# EAGLE design usb 8 button keyboard (EAGLE 7.6.0)
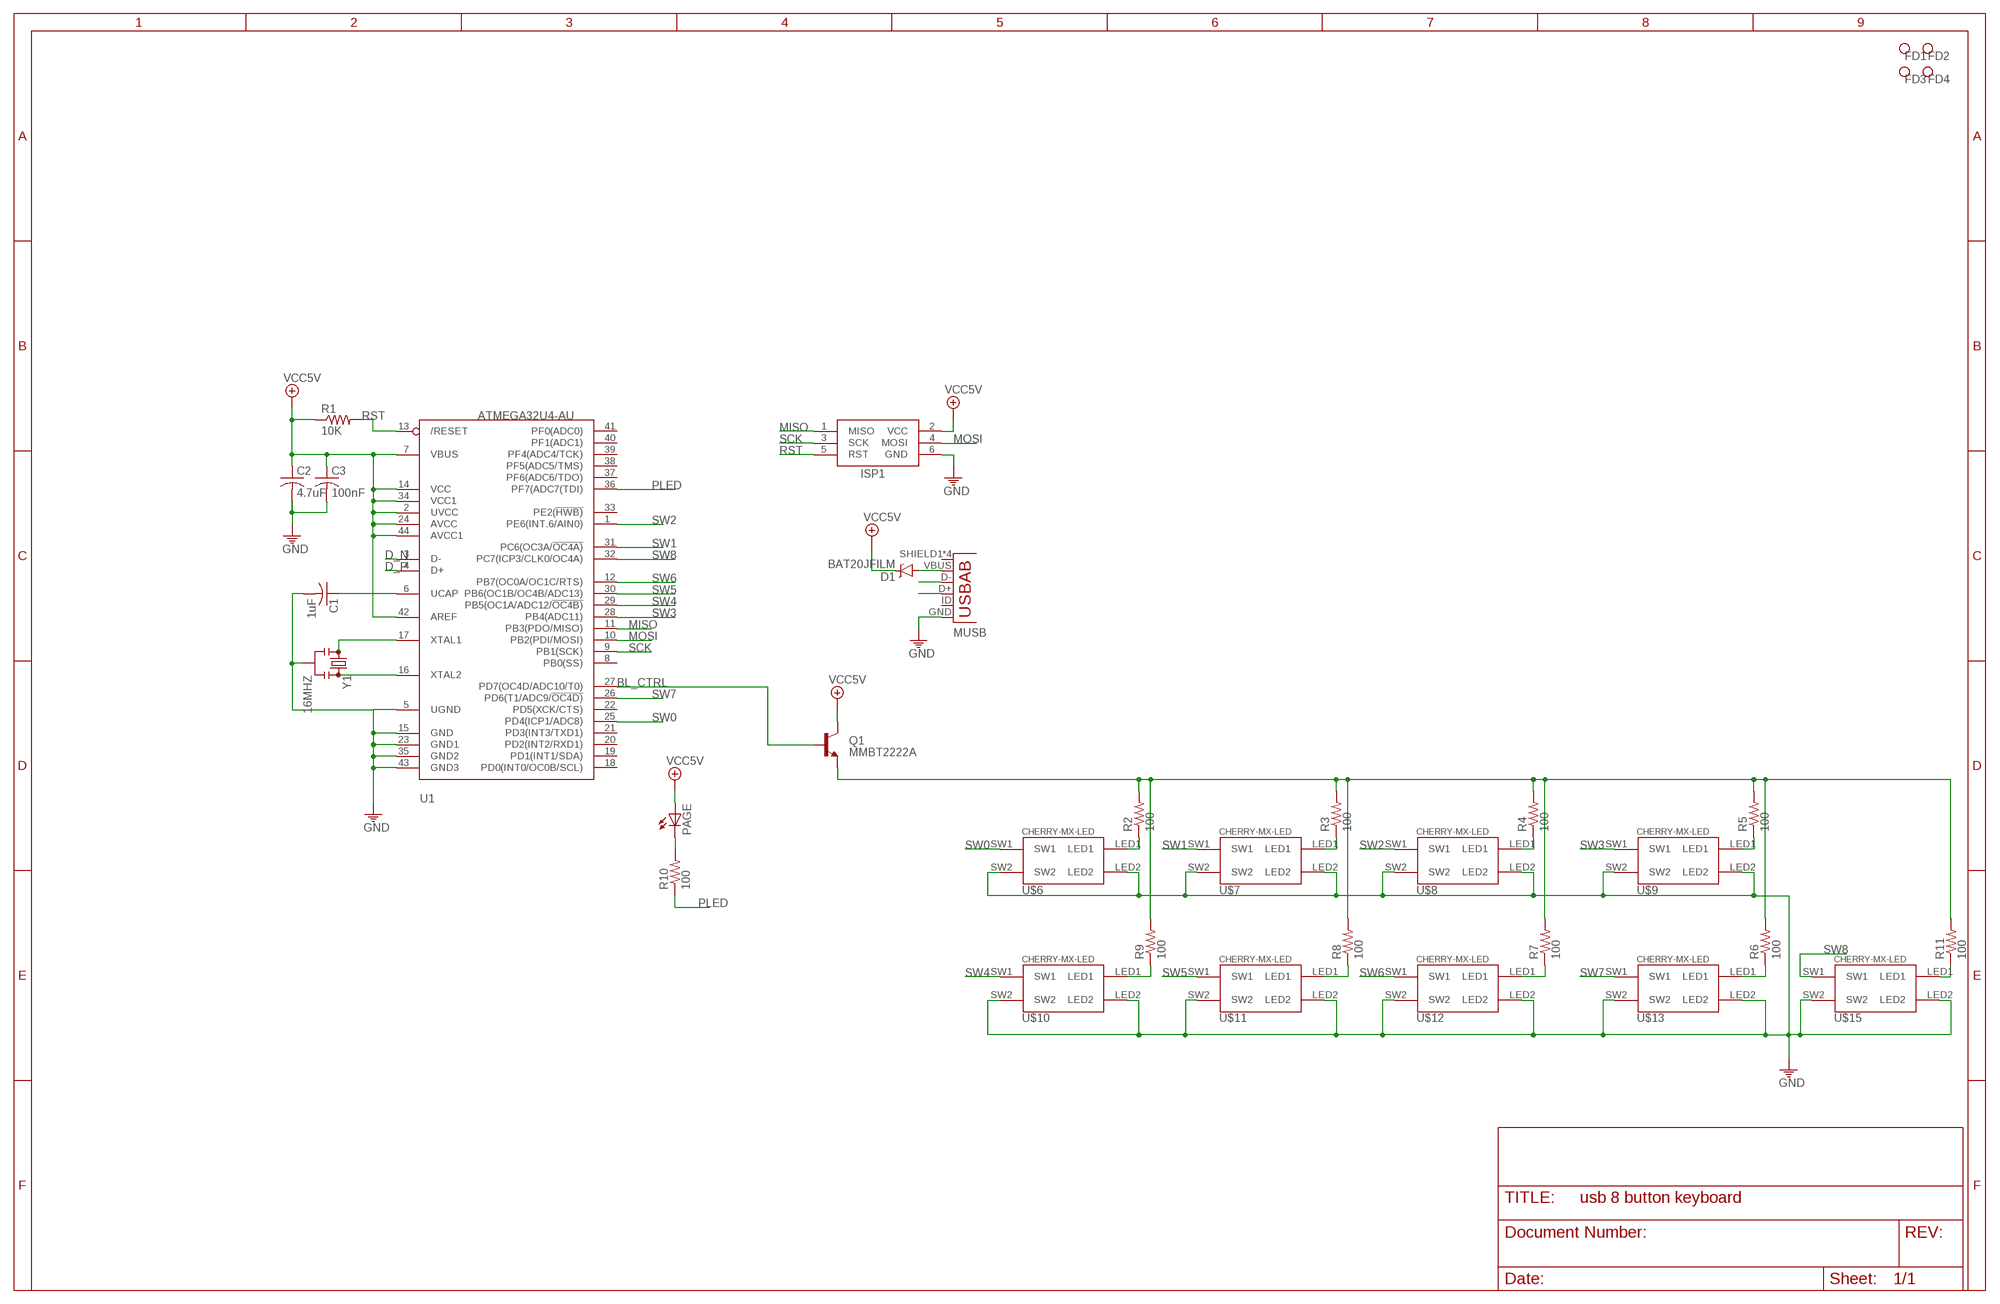
[diagram p0: schematic, sheet 1]

## Parts
C1  1uF  C-USC0402  [C0402]
C2  4.7uF  C-USC0402  [C0402]
C3  100nF  C-USC0402  [C0402]
D1  BAT20JFILM  [SOD-323]
FD1  FIDUCIAL  [FIDUCIAL_1MM]
FD2  FIDUCIAL  [FIDUCIAL_1MM]
FD3  FIDUCIAL  [FIDUCIAL_1MM]
FD4  FIDUCIAL  [FIDUCIAL_1MM]
ISP1  AVRISP-6  [AVRISP]
MUSB  USB-AB  [USB-AB-MICRO-SMD]
PAGE  LEDCHIP-LED0603  [CHIP-LED0603]
Q1  MMBT2222A  TRANSISTOR_NPNMMBT2222A  [SOT23-3]
R1  10K  R-US_R0402  [R0402]
R2  100  R-US_R0402  [R0402]
R3  100  R-US_R0402  [R0402]
R4  100  R-US_R0402  [R0402]
R5  100  R-US_R0402  [R0402]
R6  100  R-US_R0402  [R0402]
R7  100  R-US_R0402  [R0402]
R8  100  R-US_R0402  [R0402]
R9  100  R-US_R0402  [R0402]
R10  100  R-US_R0402  [R0402]
R11  100  R-US_R0402  [R0402]
U1  ATMEGA32U4-AU  [TQFP44]
U$6  CHERRY-MX-LED  [CHERRY-MX-LED]
U$7  CHERRY-MX-LED  [CHERRY-MX-LED]
U$8  CHERRY-MX-LED  [CHERRY-MX-LED]
U$9  CHERRY-MX-LED  [CHERRY-MX-LED]
U$10  CHERRY-MX-LED  [CHERRY-MX-LED]
U$11  CHERRY-MX-LED  [CHERRY-MX-LED]
U$12  CHERRY-MX-LED  [CHERRY-MX-LED]
U$13  CHERRY-MX-LED  [CHERRY-MX-LED]
U$15  CHERRY-MX-LED  [CHERRY-MX-LED]
Y1  16MHZ  RESONATOR16MHZ  [RESONATOR-SMD]

## Nets
BL: Q1.2(E) R2.2 R3.2 R4.2 R5.2 R6.2 R7.2 R8.2 R9.2 R11.2
BL_CTRL: Q1.1(B) U1.27(PD7(OC4D/ADC10/T0))
D_N: MUSB.D- U1.3(D-)
D_P: MUSB.D+ U1.4(D+)
GND: C1.2 C2.2 C3.2 ISP1.6(GND) MUSB.GND U1.5(UGND) U1.15(GND) U1.23(GND1) U1.35(GND2) U1.43(GND3) U$6.LED2 U$6.SW2 U$7.LED2 U$7.SW2 U$8.LED2 U$8.SW2 U$9.LED2 U$9.SW2 U$10.LED2 U$10.SW2 U$11.LED2 U$11.SW2 U$12.LED2 U$12.SW2 U$13.LED2 U$13.SW2 U$15.LED2 U$15.SW2 Y1.2
MISO: ISP1.1(MISO) U1.11(PB3(PDO/MISO))
MOSI: ISP1.4(MOSI) U1.10(PB2(PDI/MOSI))
N$2: D1.A MUSB.VBUS
N$3: PAGE.C R10.2
N$4: R11.1 U$15.LED1
N$5: R2.1 U$6.LED1
N$6: U1.16(XTAL2) Y1.3
N$7: U1.17(XTAL1) Y1.1
N$8: C1.1 U1.6(UCAP)
N$9: R3.1 U$7.LED1
N$10: R4.1 U$8.LED1
N$11: R5.1 U$9.LED1
N$12: R6.1 U$13.LED1
N$13: R7.1 U$12.LED1
N$14: R8.1 U$11.LED1
N$15: R9.1 U$10.LED1
PLED: R10.1 U1.36(PF7(ADC7(TDI))
RST: ISP1.5(RST) R1.2 U1.13(/RESET)
SCK: ISP1.3(SCK) U1.9(PB1(SCK))
SW0: U1.25(PD4(ICP1/ADC8)) U$6.SW1
SW1: U1.31(PC6(OC3A/!OC4A)) U$7.SW1
SW2: U1.1(PE6(INT.6/AIN0)) U$8.SW1
SW3: U1.28(PB4(ADC11)) U$9.SW1
SW4: U1.29(PB5(OC1A/ADC12/!OC4B)) U$10.SW1
SW5: U1.30(PB6(OC1B/OC4B/ADC13)) U$11.SW1
SW6: U1.12(PB7(OC0A/OC1C/RTS)) U$12.SW1
SW7: U1.26(PD6(T1/ADC9/!OC4D)) U$13.SW1
SW8: U1.32(PC7(ICP3/CLK0/OC4A)) U$15.SW1
VCC5V: C2.1 C3.1 D1.C ISP1.2(VCC) PAGE.A Q1.3(C) R1.1 U1.2(UVCC) U1.7(VBUS) U1.14(VCC) U1.24(AVCC) U1.34(VCC1) U1.42(AREF) U1.44(AVCC1)
Unconnected: MUSB.ID(USBID) MUSB.SHIELD1(SHIELD) MUSB.SHIELD2(SHIELD) MUSB.SHIELD3(SHIELD) MUSB.SHIELD4(SHIELD) U1.8(PB0(SS)) U1.18(PD0(INT0/OC0B/SCL)) U1.19(PD1(INT1/SDA)) U1.20(PD2(INT2/RXD1)) U1.21(PD3(INT3/TXD1)) U1.22(PD5(XCK/CTS)) U1.33(PE2(!HWB)) U1.37(PF6(ADC6/TDO)) U1.38(PF5(ADC5/TMS)) U1.39(PF4(ADC4/TCK)) U1.40(PF1(ADC1)) U1.41(PF0(ADC0))

## Library data of the parts
C1-C3 = cheeper:C-US: CAPACITOR, American symbol
D1 = SparkFun-DiscreteSemi:BAT20JFILM: 23V, 1A Schottky diode, SOD-323 package; PROD_ID: DIO-11623
FD1-FD4 = ChipTestJig:FIDUCIAL; ASSEMBLE: N.C; DESCRIPTION: Fiducial; PART_NUMBER: RB00000042
ISP1 = adafruit:AVRISP: AVR ISP HEADER Standard 6 pin header for AVR programming
MUSB = SparkFun-Connectors:USB-AB: This is a USB AB connector that is compatible with USB OTG. i.e. this connector can serve as a host or device
PAGE = adafruit:LED: LED OSRAM: - CHIPLED LG R971, LG N971, LY N971, LG Q971, LY Q971, LO R971, LY R971 LH N974, LH R974 LS Q976, LO Q976, LY Q976 LO Q996 - Hyper CHIPLED LW Q18S LB Q993, LB Q99A, LB R99A - SideLED LS A670, LO A670, LY A670, LG A670, LP A670 LB A673, LV A673, LT A673, LW A673 LH A674 LY A675 LS A676, LA A676, LO A676, LY A676, LW A676 LS A679, LY A679, LG A679 - Hyper Micro SIDELED® LS Y876, LA Y876, LO Y876, LY Y876 LT Y87S - SmartLED LW L88C, LW L88S LB L89C, LB L89S, LG L890 LS L89K, LO L89K, LY L89K LS L896, LA L896, LO L896, LY L896 - TOPLED LS T670, LO T670, LY T670, LG T670, LP T670 LSG T670, LSP T670, LSY T670, LOP T670, LYG T670 LG T671, LOG T671, LSG T671 LB T673, LV T673, LT T673, LW T673 LH T674 LS T676, LA T676, LO T676, LY T676, LB T676, LH T676, LSB T676, LW T676 LB T67C, LV T67C, LT T67C, LS T67K, LO T67K, LY T67K, LW E67C LS E67B, LA E67B, LO E67B, LY E67B, LB E67C, LV E67C, LT E67C LW T67C LS T679, LY T679, LG T679 LS T770, LO T770, LY T770, LG T770, LP T770 LB T773, LV T773, LT T773, LW T773 LH T774 LS E675, LA E675, LY E675, LS T675 LS T776, LA T776, LO T776, LY T776, LB T776 LHGB T686 LT T68C, LB T68C - Hyper Mini TOPLED® LB M676 - Mini TOPLED Santana® LG M470 LS M47K, LO M47K, LY M47K Source: http://www.osram.convergy.de/
Q1 = SparkFun-DiscreteSemi:TRANSISTOR_NPN: Generic NPN BJT MMBT2222A - TRANS-08049 (SOT-23, 1A 40V) MPSA42 - TRANS-09116 (SOT-23, 500mA 300V) MMBT5088LT1G - TRANS-11160 (SOT-23, 50 mA 30V) BC547 - COM-08928 <http://www.sparkfun.com/products/8928> (TO-92 45V 100mA) (1.Collector 2.Base 3.Emitter) 2N3904 - COM-00521 <http://www.sparkfun.com/products/521> (TO-92 40V 200mA) (1.Emitter 2.Base 3.Collector) P2N2222A - COM-12852 <http://www.sparkfun.com/products/12852> (TO-92 40V 600mA) (1.Collector 2.Base 3.Emitter); PROD_ID: TRANS-08049
R1-R11 = cheeper:R-US_: RESISTOR, American symbol
U1 = adafruit:ATMEGA32U4: http://www.ladyada.net/library/eagle
U$6-U$13 U$15 = cherrymx:CHERRY-MX-LED: Cherry MX series keyswitch with LED
Y1 = SparkFun-FreqCtrl:RESONATOR: Resonator Small SMD resonator. Used, eg, on the Arduino Pro/ Pro Mini boards. 8MHz- XTAL-08895 16MHz- XTAL-08900; PROD_ID: XTAL-08900

## Board
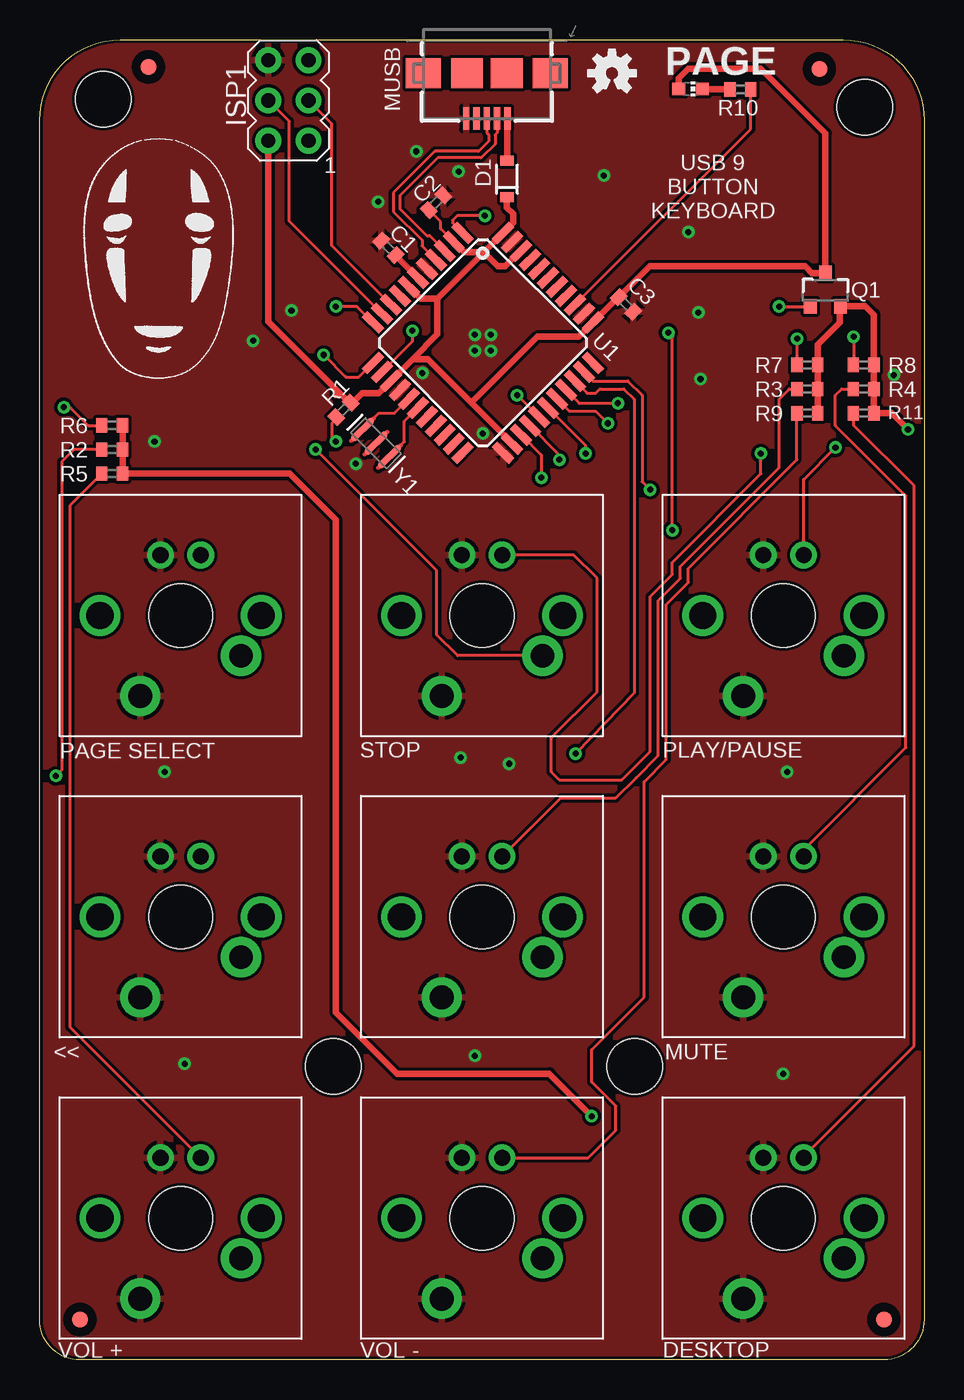
[diagram p1: board, top side]
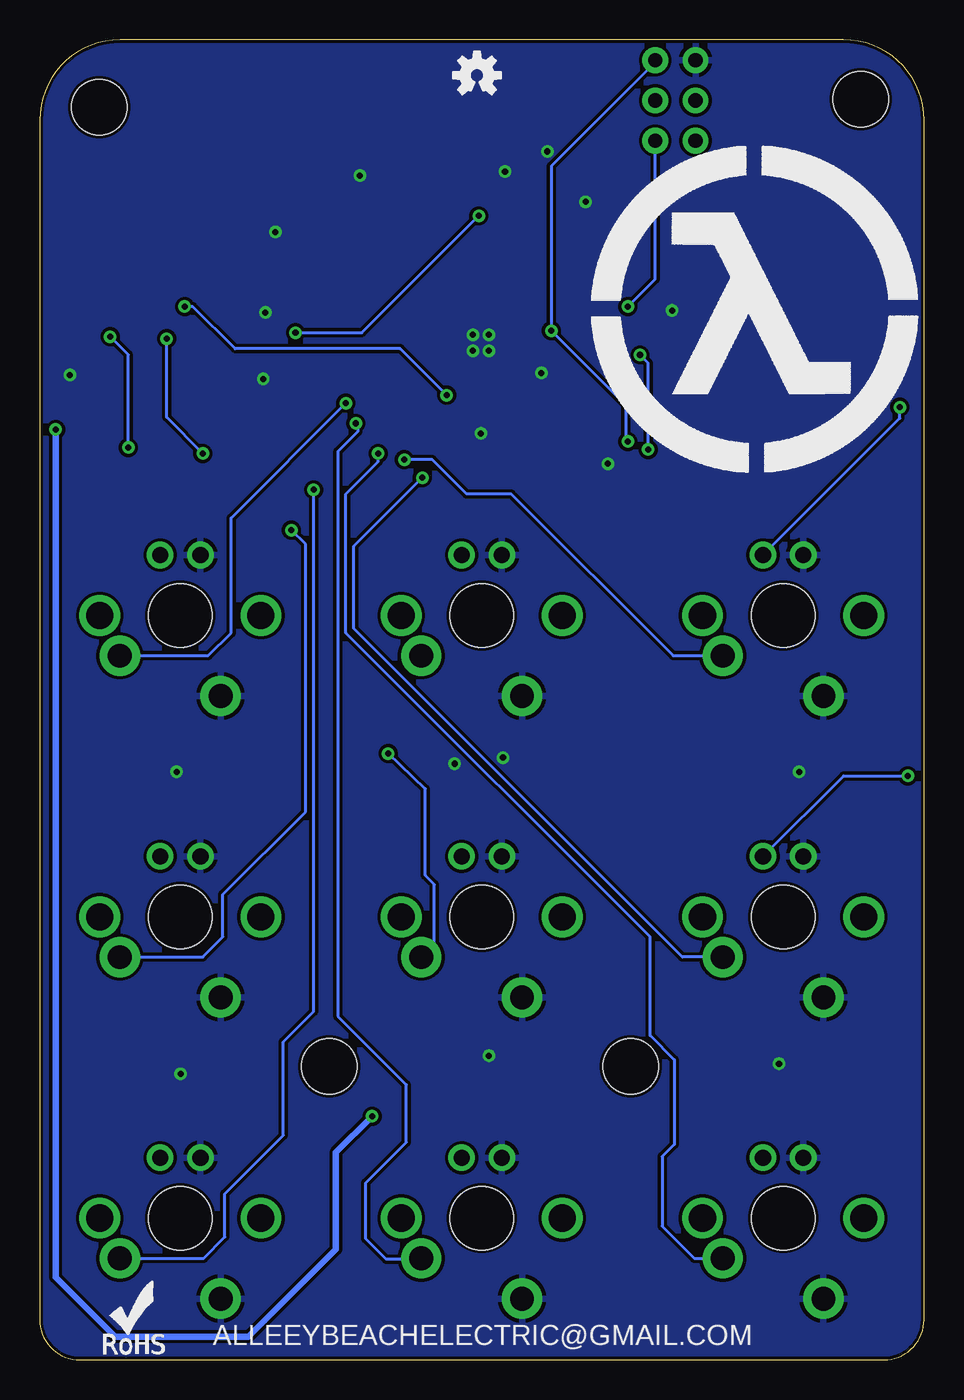
[diagram p2: board, bottom side, seen from below]

Size 55.75 x 83.25 mm. Coordinates in mm from the lower left corner, seen from the top.
Outline: 53.21,0 2.54,0 arc-90 0,2.54 0,78.17 arc-90 5.08,83.25 50.67,83.25 arc-90 55.75,78.17 55.75,2.54 arc-90 53.21,0
Copper layers (1*2*15*16): Top 0.035mm / dielectric 0.2mm / Route2 0.035mm / dielectric 0.2mm / Route15 0.035mm / dielectric 0.2mm / Bottom 0.035mm
Design rules "NTC": minimum track width 7mil, minimum drill 10mil, track to track 8mil, track to pad 8mil, pad to pad 8mil, via to via 8mil, smd to smd 3mil, copper to edge 8mil, drill to drill 8mil, minimum pad ring 10mil, minimum via ring 8mil, stop-mask expansion 4mil, vias tented up to drill 0.3mm, thermal gap 10mil
Holes 3.5 mm at 18.5,18.5 4,79.5 52,79 37.5,18.5

### Footprints (pad centres in the part's own frame; a part is rotated, then mirrored left to right if it is on the bottom)
C0402 = smd 0.7 x 0.9: 1 -0.65,0; 2 0.65,0
SOD-323 = smd 0.63 x 0.83: A 1.15,0; C -1.15,0
FIDUCIAL_1MM = smd 1 x 1: 1 0,0
AVRISP = drill 0.9 pad 1.626: 1 -1.27,2.54; 2 1.27,2.54; 3 -1.27,0; 4 1.27,0; 5 -1.27,-2.54; 6 1.27,-2.54
USB-AB-MICRO-SMD = smd 1.4 x 0.4: D+ 2.85,0; D- 2.85,0.65; GND 2.85,-1.3; ID 2.85,-0.65; VBUS 2.85,1.3 | smd 1.9 x 2.2: SHIELD1 0,4; SHIELD4 0,-4 | smd 1.9 x 2: SHIELD2 0,1.25; SHIELD3 0,-1.25
CHIP-LED0603 = smd 0.8 x 0.8: A 0,-0.75; C 0,0.75
SOT23-3 = smd 0.8 x 0.9: 1 -0.95,-1; 2 0.95,-1; 3 0,1.1
R0402 = smd 0.7 x 0.9: 1 -0.65,0; 2 0.65,0
TQFP44 = smd 1.5 x 0.5: 1 -5.8,4; 2 -5.8,3.2; 3 -5.8,2.4; 4 -5.8,1.6; 5 -5.8,0.8; 6 -5.8,0; 7 -5.8,-0.8; 8 -5.8,-1.6; 9 -5.8,-2.4; 10 -5.8,-3.2; 11 -5.8,-4; 23 5.8,-4; 24 5.8,-3.2; 25 5.8,-2.4; 26 5.8,-1.6; 27 5.8,-0.8; 28 5.8,0; 29 5.8,0.8; 30 5.8,1.6; 31 5.8,2.4; 32 5.8,3.2; 33 5.8,4 | smd 0.5 x 1.5: 12 -4,-5.8; 13 -3.2,-5.8; 14 -2.4,-5.8; 15 -1.6,-5.8; 16 -0.8,-5.8; 17 0,-5.8; 18 0.8,-5.8; 19 1.6,-5.8; 20 2.4,-5.8; 21 3.2,-5.8; 22 4,-5.8; 34 4,5.8; 35 3.2,5.8; 36 2.4,5.8; 37 1.6,5.8; 38 0.8,5.8; 39 0,5.8; 40 -0.8,5.8; 41 -1.6,5.8; 42 -2.4,5.8; 43 -3.2,5.8; 44 -4,5.8
CHERRY-MX-LED = drill 1.016 pad 1.676: LED1 -1.27,-3.81; LED2 1.27,-3.81 | drill 1.714 pad 1.93: P$3 -5.08,0; P$4 5.08,0 | drill 1.5 pad 2.54: SW1 -3.81,2.54; SW2 2.54,5.08 | hole 4: 0,0
RESONATOR-SMD = smd 0.45 x 1.905: 1 -1.2,0; 2 0,0; 3 1.2,0

### Placement (x,y rotation side)
C1  21.98,70.13 135 top
C2  24.99,72.97 45 top
C3  36.96,66.55 315 top
D1  29.46,74.46 90 top
FD1  2.54,2.54 0 top
FD2  6.86,81.53 0 top
FD3  49.15,81.41 0 top
FD4  53.21,2.54 0 top
ISP1  15.68,79.41 180 top
MUSB  28.19,81.13 270 top
PAGE  41.04,80.14 270 top
Q1  49.53,67.44 0 top
R1  19.16,59.9 225 top
R2  4.57,57.4 0 top
R3  48.39,61.21 0 top
R4  51.94,61.21 0 top
R5  4.57,55.88 0 top
R6  4.57,58.93 0 top
R7  48.39,62.74 0 top
R8  51.94,62.74 0 top
R9  48.39,59.69 0 top
R10  44.16,80.11 180 top
R11  51.94,59.69 0 top
U1  27.94,64.14 315 top
U$1  [OSHW-LOGO-S]  28.19,81 0 bottom
U$6  8.88,27.94 180 top
U$7  27.88,27.94 180 top
U$8  46.88,27.94 180 top
U$9  8.88,8.94 180 top
U$10  27.88,8.94 180 top
U$11  46.88,46.94 180 top
U$12  27.88,46.94 180 top
U$13  8.88,46.94 180 top
U$15  46.88,8.94 180 top
U$16  [OSHW-LOGO-S]  36.08,81.13 0 top
U$17  [ROHS_LOGO_0.18_IN]  51.94,0.25 0 bottom
Y1  21.2,57.81 135 top

### Tracks (layer width: path | path; a pad name or v marks a point on that pad's centre or on a via)
BL  (via drill 0.38)
  Top 0.406: R9.2 R3.2 R7.2 49.04,64.02 50.42,65.41 50.42,66.38 Q1.2 52.05,66.44 52.58,65.91 52.58,62.75 R8.2 R4.2 R11.2 53.72,59.69 v54.74,58.67 | R6.2 R2.2 R5.2 15.77,55.88 18.67,52.98 18.67,21.91 22.54,18.03 32.13,18.03 v34.8,15.37
  Bottom 0.406: v54.74,58.67 54.74,5.21 50.99,1.46 42.6,1.46 37.08,6.98 37.08,13.08 v34.8,15.37
BL_CTRL  (via drill 0.38)
  Top 0.203: U1.27 30.11,60.83 v30.1,60.83 | v46.61,66.42 48.56,66.42 Q1.1
  Bottom 0.203: v30.1,60.83 33.02,63.75 43.43,63.75 46.1,66.42 v46.61,66.42
D_N
  Top 0.178: 24.39,70.89 24.57,70.89 U1.3
  Top 0.203: MUSB.D- 28.84,77.38 28.7,77.25 28.7,76.67 27.83,75.8 25.08,75.8 22.7,73.42 22.7,72.58 24.39,70.89
D_P
  Top 0.203: MUSB.D+ 28.19,77.36 28.3,77.25 28.3,76.83 27.67,76.2 24.92,76.2 22.3,73.58 22.3,72.42 24.11,70.61 24.11,70.23 U1.4
GND  (via drill 0.38)
  other vias: 35.56,74.68 23.75,76.2 26.42,74.93 21.34,73.03 15.88,66.17 13.46,64.26 40.89,71.12 41.53,66.04 41.66,61.85 7.24,57.91 53.85,62.1 27.43,19.18 9.14,18.67 46.86,18.03 26.54,37.97 7.87,37.08 29.59,37.59 47.12,37.08 19.94,56.52 24.13,62.23 27.94,58.42 27.43,63.63 27.43,64.64 28.45,64.64 28.45,63.63
  pour Top: 53.21,0 2.54,0 arc-90 0,2.54 0,78.23 arc-90 5.08,83.31 50.67,83.31 arc-90 55.75,78.23 55.75,2.54 arc-90
  pour Bottom: 53.21,0 2.54,0 arc-90 0,2.54 0,78.23 arc-90 5.08,83.31 50.67,83.31 arc-90 55.75,78.23 55.75,2.54 arc-90
MISO  (via drill 0.38)
  Top 0.203: U1.11 20,66.42 v18.67,66.42
  Bottom 0.203: ISP1.1 16.95,68.14 v18.67,66.42
MOSI
  Top 0.203: U1.10 15.75,71.8 15.75,78.11 14.44,79.41 ISP1.4 14.57,79.29
N$2
  Top 0.406: D1.A 29.49,75.61 MUSB.VBUS
N$3
  Top 0.406: PAGE.C 41.82,80.11 R10.2
N$4
  Top 0.203: R11.1 51.31,59.67 51.31,58.93 55.12,55.12 55.12,19.81 48.15,12.85 U$15.LED1
N$5  (via drill 0.38)
  Top 0.203: R2.1 2.16,57.4 1.4,56.64 1.4,37.21 v1.02,36.83
  Bottom 0.203: U$6.LED1 5.07,36.83 v1.02,36.83
N$6
  Top 0.203: 21.07,59.38 21.39,59.69 22.35,59.69 U1.16
N$7
  Top 0.203: 22.77,57.68 22.99,57.9 22.99,59.18 U1.17
N$8
  Top 0.406: U1.6 22.44,69.64 C1.1
N$9
  Top 0.203: R3.1 47.24,61.21 46.61,60.58 46.61,56.26 40.39,50.04 40.39,49.28 38.99,47.88 38.99,38.1 37.59,36.7 36.32,35.43 32.84,35.43 U$7.LED1
N$10
  Top 0.203: R4.1 50.55,61.21 50.16,60.83 50.16,58.93 54.61,54.48 54.61,38.61 48.15,32.15 U$8.LED1
N$11
  Top 0.203: R5.1 1.91,53.86 1.91,21 U$9.LED1
N$12  (via drill 0.38)
  Top 0.203: 3.94,58.94 R6.1 3.05,58.93 1.91,60.07 v1.52,60.07
  Bottom 0.203: U$13.LED1 1.52,59.38 v1.52,60.07
N$13  (via drill 0.38)
  Top 0.203: v45.47,57.15 45.47,55.88 39.88,50.29 39.88,49.53 38.48,48.13 38.48,38.35 36.7,36.58 32.77,36.58 32.26,37.08 32.26,39.24 35.14,42.12 35.14,49.29 33.68,50.75 U$12.LED1 | v47.75,64.39 47.74,64.37 R7.1
  Bottom 0.203: v45.47,57.15 47.75,59.44 v47.75,64.39
N$14  (via drill 0.38)
  Top 0.203: v51.31,64.52 51.31,62.75 R8.1 | U$11.LED1 48.15,55.52 v50.16,57.53
  Bottom 0.203: v50.16,57.53 50.16,63.37 v51.31,64.52
N$15
  Top 0.203: R9.1 47.74,56.75 40.89,49.91 40.89,49.02 39.5,47.62 39.5,37.85 38.1,36.45 38.1,22.86 34.8,19.56 34.8,17.53 36.32,16 36.32,14.48 34.59,12.75 U$10.LED1
PLED
  Top 0.203: U1.36 44.81,77.61 R10.1
RST  (via drill 0.38)
  Top 0.203: v23.5,64.9 23.5,64.22 U1.13 | R1.2 18.7,59.34 18.41,59.05 18.41,58.17 v18.67,57.91
  Bottom 0.203: v18.67,57.91 18.8,58.04 18.8,60.2 v23.5,64.9 23.5,75.28 16.95,81.83 ISP1.5
SCK
  Top 0.203: U1.9 18.41,70.27 18.41,77.95 ISP1.3
SW0  (via drill 0.38)
  Top 0.203: U1.25 31.62,57.06 v31.62,55.63
  Bottom 0.203: v31.62,55.63 35.94,51.31 35.94,46.1 15.24,25.4 U$6.SW1
SW1  (via drill 0.38)
  Top 0.203: U1.31 34.51,60.96 35.05,60.96 35.31,61.21 36.83,61.21 37.47,60.58 37.47,42.04 v33.78,38.23
  Bottom 0.203: v33.78,38.23 31.44,36.01 31.44,30.55 30.86,29.97 30.86,26.23 U$7.SW1
SW2  (via drill 0.38)
  Top 0.203: v28.07,72.14 26.32,72.14 26.04,71.85 26.04,71.7 U1.1 | v39.88,52.32 39.88,64.52 v39.62,64.77
  Bottom 0.203: v39.88,52.32 38.99,51.44 38.99,34.56 44.2,29.36 44.2,26.67 45.47,25.4 U$8.SW1 | v39.62,64.77 35.43,64.77 v28.07,72.14
SW3  (via drill 0.38)
  Top 0.203: v34.42,57.15 34.42,57.66 U1.28
  Bottom 0.203: v34.42,57.15 34.42,56.64 36.45,54.61 36.45,45.85 17.27,26.67 17.27,20.45 15.75,18.92 15.75,13.59 16.51,12.83 16.51,8.43 14.48,6.4 U$9.SW1
SW4  (via drill 0.38)
  Top 0.203: U1.29 33.39,59.82 35.05,59.82 v35.81,59.05
  Bottom 0.203: v35.81,59.05 35.69,58.93 35.69,58.55 36.96,57.28 36.96,21.67 32.64,17.35 32.64,13.72 35.18,11.18 35.18,7.62 33.91,6.35 31.74,6.35 U$10.SW1
SW5  (via drill 0.38)
  Top 0.203: U1.30 34.01,60.33 v36.45,60.33
  Bottom 0.203: v36.45,60.33 43.69,53.09 43.69,45.85 45.14,44.4 U$11.SW1
SW6  (via drill 0.38)
  Top 0.203: v17.91,63.37 19.3,61.98 20.12,61.98 U1.12 | 17.53,57.4 v17.4,57.4 25.02,49.78 25.02,45.72 26.34,44.4 U$12.SW1
  Bottom 0.203: v17.4,57.4 17.4,62.87 v17.91,63.37
SW7  (via drill 0.38)
  Top 0.203: v32.77,56.77 32.77,57.05 U1.26
  Bottom 0.203: v32.77,56.77 30.99,56.77 28.83,54.61 26.04,54.61 15.82,44.4 U$13.SW1
SW8  (via drill 0.38)
  Top 0.203: U1.32 34.88,61.72 37.08,61.72 37.97,60.83 37.97,55.37 v38.48,54.86
  Bottom 0.203: v38.48,54.86 38.48,21.97 40.39,20.07 40.39,14.17 44.07,10.48 44.07,7.75 45.42,6.4 U$15.SW1
VCC5V
  Top 0.203: U1.2 25.27,71.33 25.27,71.77 C2.1
  Top 0.406: D1.C 29.46,72.65 29.84,72.26 29.84,71.7 U1.44 28,69.85 | 28,69.85 26.75,69.85 U1.2 | U1.7 24.02,66.93 25.08,66.93 | 28,69.85 25.08,66.93 | 23.51,63.1 U1.14 21.37,60.96 20.32,60.96 19.72,60.36 R1.1 19.52,60.36 19.05,60.83 | 23.51,63.1 25.08,64.67 25.08,66.93 | U1.24 27.2,60.35 | 27.2,60.35 24.45,63.1 23.51,63.1 | 28,69.85 28.89,68.96 29.34,68.96 30.31,69.93 U1.42 | 18.67,60.83 19.05,60.83 | ISP1.2 14.41,65.47 19.05,60.83 | PAGE.A 40.29,80.8 40.89,81.41 45.47,81.41 49.53,77.34 Q1.3 48.68,68.54 48.26,68.96 38.45,68.96 C3.1 36.47,67.01 U1.34 33.98,64.52 31.37,64.52 27.2,60.35

### Text on the board
tPlace: USB 9 / BUTTON / KEYBOARD | PAGE SELECT | STOP | PLAY/PAUSE | << | MUTE | VOL + | VOL - | DESKTOP
bPlace: ALLEEYBEACHELECTRIC@GMAIL.COM